# Altium schematic sheet StepperV2.SchDoc
size Letter; SheetNumber: 1; SheetTotal: 1
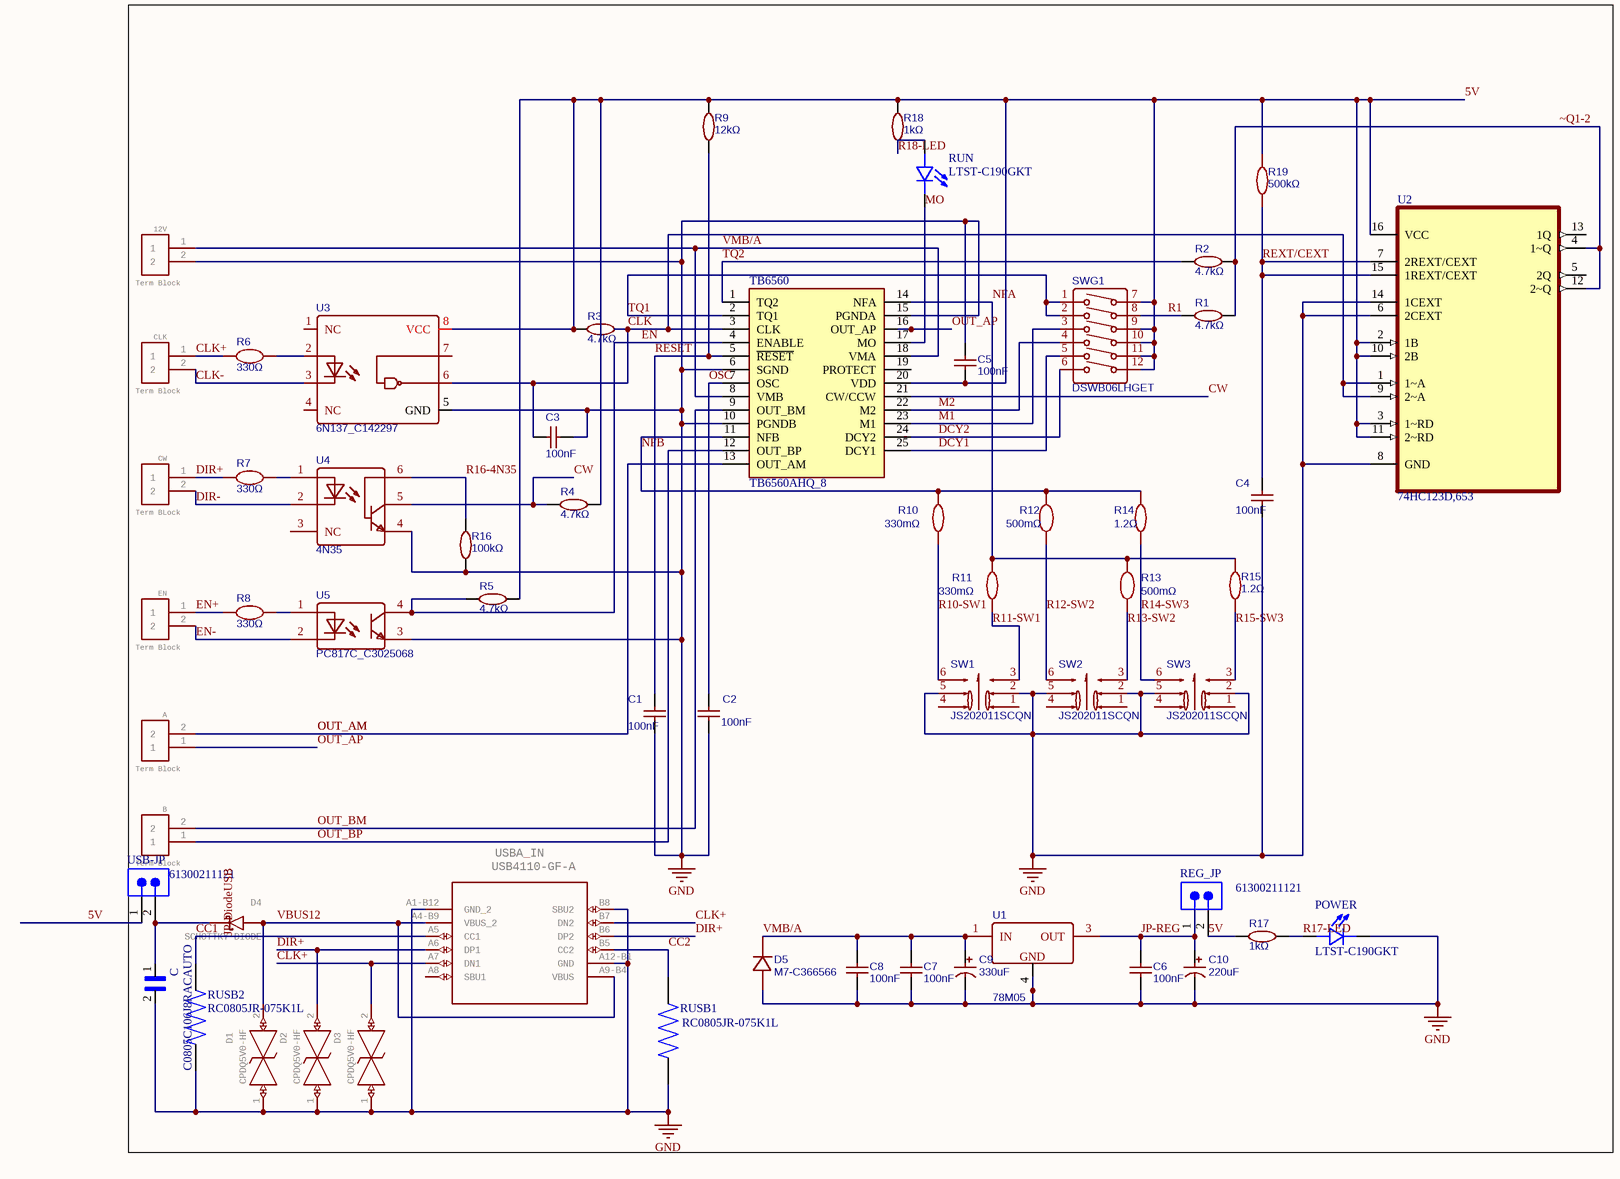
[diagram p0: StepperV2.SchDoc]

## Parts
12V  Term Block  [TE_282837-2]
A  Term Block  [TE_282837-2]
B  Term Block  [TE_282837-2]
C  C0805C106J8RACAUTO  [CAPC2012X88N]
C1  100nF  [C0805]
C2  100nF  [C0805]
C3  100nF  [C0805]
C4  100nF  [C0805]
C5  100nF  [C0805]
C6  100nF  [C0805]
C7  100nF  [C0805]
C8  100nF  [C0805]
C9  330uF  [CAP-TH_BD8.0-P3.50-D0.6-FD]
C10  220uF  [CAP-TH_BD6.3-P2.50-D1.0-FD]
CLK  Term Block  [TE_282837-2]
CW  Term BLock  [TE_282837-2]
D1  CPDQ5V0-HF  [MBTB-D-SOD-923F-IMP-0402]
D2  CPDQ5V0-HF  [MBTB-D-SOD-923F-IMP-0402]
D3  CPDQ5V0-HF  [MBTB-D-SOD-923F-IMP-0402]
D4  SCHOTTKY DIODE  [SOD3715X145N]
D5  M7-C366566  [SMAF_L3.5-W2.6-LS4.7-RD]
EN  Term Block  [TE_282837-2]
POWER  LTST-C190GKT  [LEDC1608X35N]
R1  4.7kΩ  [R0805]
R2  4.7kΩ  [R0805]
R3  4.7kΩ  [R0805]
R4  4.7kΩ  [R0805]
R5  4.7kΩ  [R0805]
R6  330Ω  [R0805]
R7  330Ω  [R0805]
R8  330Ω  [R0805]
R9  12kΩ  [R0805]
R10  330mΩ  [R2512]
R11  330mΩ  [R2512]
R12  500mΩ  [R2512]
R13  500mΩ  [R2512]
R14  1.2Ω  [R1210]
R15  1.2Ω  [R1210]
R16  100kΩ  [R0805]
R17  1kΩ  [R0805]
R18  1kΩ  [R0805]
R19  500kΩ  [R0805]
REG_JP  61300211121  [61300211121]
RUN  LTST-C190GKT  [LEDC1608X35N]
RUSB1  RC0805JR-075K1L  [RESC2012X60N]
RUSB2  RC0805JR-075K1L  [RESC2012X60N]
SW1  JS202011SCQN  [SW-SMD_JS202011SCQN]
SW2  JS202011SCQN  [SW-SMD_JS202011SCQN]
SW3  JS202011SCQN  [SW-SMD_JS202011SCQN]
SWG1  DSWB06LHGET  [SW-TH_DSWB06LHGET]
TB6560  TB6560AHQ_8  [TO127P530X3650X1770-25P]
U1  78M05  [TO-252-2_L6.5-W6.1-P4.58-LS10.0-TL]
U2  74HC123D,653  [SOIC127P600X175-16N]
U3  6N137_C142297  [DIP-8_L9.8-W6.6-P2.54-LS7.6-BL]
U4  4N35  [DIP-6_L8.5-W6.4-P2.54-LS7.6-BL]
U5  PC817C_C3025068  [DIP-4_L4.6-W6.5-P2.54-LS7.6-BL]
USB-JP  61300211121  [61300211121]
USBA_IN  USB4110-GF-A  [USB4110-GF-A_GCT]

## Nets
GND: 12V.2 C.2 C1.1 C2.2 C3.2 C4.1 C5.2 C6.1 C7.1 C8.1 C9.2 C10.2 D1.1(K) D2.1(K) D3.1(K) D5.2(A) POWER.C R16.1 RUSB1.1 RUSB2.1 SW1.2 SW1.5 SW2.2 SW2.5 SW3.2 SW3.5 TB6560.6(SGND) TB6560.10(PGNDB) TB6560.15(PGNDA) U1.4(GND) U2.6(2CEXT) U2.8(GND) U2.14(1CEXT) U3.5(GND) U4.4 U5.3(EM) USBA_IN.A1-B12(GND_2) USBA_IN.A12-B1(GND) USBA_IN.B8(SBU2)
5V: C5.1 R3.1 R4.2 R5.2 R9.2 R17.1 R18.2 R19.2 REG_JP.2 SWG1.7 SWG1.9 SWG1.10 SWG1.11 SWG1.12 TB6560.20(VDD) U2.2(1B) U2.3(1~RD) U2.10(2B) U2.11(2~RD) U2.16(VCC) U3.8(VCC) USB-JP.1
CC1: RUSB2.2 USBA_IN.A5(CC1)  [also labelled JP-DiodeUSB]
CC2: RUSB1.2 USBA_IN.B5(CC2)
CLK: C3.1 R3.2 TB6560.3(CLK) U2.1(1~A) U2.9(2~A) U3.6(VOUT)
CLK+: CLK.1 D3.2(A) R6.1 USBA_IN.A7(DN1) USBA_IN.B7(DN2)
CLK-: CLK.2 U3.3(CAT)
CW: R4.1 TB6560.21(CW/CCW) U4.5
DCY1: SWG1.5 TB6560.25(DCY1)
DCY2: SWG1.6 TB6560.24(DCY2)
DIR+: CW.1 D2.2(A) R7.1 USBA_IN.A6(DP1) USBA_IN.B6(DP2)
DIR-: CW.2 U4.2
EN: R5.1 TB6560.4(ENABLE) U5.4(COL)
EN+: EN.1 R8.1
EN-: EN.2 U5.2(CAT)
JP-REG: C6.2 C10.1 REG_JP.1 U1.3(OUT)
M1: SWG1.3 TB6560.23(M1)
M2: SWG1.4 TB6560.22(M2)
MO: RUN.C TB6560.17(MO)
NFA: R11.2 R13.2 R15.2 TB6560.14(NFA)
NFB: R10.2 R12.2 R14.2 TB6560.11(NFB)
OSC: C2.1 TB6560.7(OSC)
OUT_AM: A.2 TB6560.13(OUT_AM)
OUT_AP: A.1 TB6560.16(OUT_AP)
OUT_BM: B.2 TB6560.9(OUT_BM)
OUT_BP: B.1 TB6560.12(OUT_BP)
R1: R1.1 SWG1.8
R10-SW1: R10.1 SW1.6
R11-SW1: R11.1 SW1.3
R12-SW2: R12.1 SW2.6
R13-SW2: R13.1 SW2.3
R14-SW3: R14.1 SW3.6
R15-SW3: R15.1 SW3.3
R16-4N35: R16.2 U4.6
R17-LED: POWER.A R17.2
R18-LED: R18.1 RUN.A
RESET: C1.2 R9.1 TB6560.5(~{RESET})
REXT/CEXT: C4.2 R19.1 U2.7(2REXT/CEXT) U2.15(1REXT/CEXT)
TQ1: SWG1.1 SWG1.2 TB6560.2(TQ1)
TQ2: R2.1 TB6560.1(TQ2)
VBUS12: D1.2(A) D4.A USBA_IN.A4-B9(VBUS_2) USBA_IN.A9-B4(VBUS)
VMB/A: 12V.1 C7.2 C8.2 C9.1 D5.1(C) TB6560.8(VMB) TB6560.18(VMA) U1.1(IN)
~Q1-2: R1.2 R2.2 U2.4(1~Q) U2.12(2~Q)
NetC_1: C.1 D4.C(K) USB-JP.2
NetR6_2: R6.2 U3.2(AN)
NetR7_2: R7.2 U4.1
NetR8_2: R8.2 U5.1(AN)

Not connected (* = marked no-connect by the designer): SW1 1 4; SW2 1 4; SW3 1 4; TB6560 19(PROTECT); U2 5(2Q) 13(1Q); U3 1(NC) 4(NC) 7(VE); U4 3(NC); USBA_IN A8(SBU1)

## Library data of the parts
12V A B CLK CW EN = 282837-2: GateName_1: G$1; MF: TE Connectivity; SymbolName_1: 282837-2; LibraryName: Terminal_Block2P; DeviceSetName: 282837-2; Package: TE_282837-2; Package: None; Price: None; Check_prices: https://www.snapeda.com/parts/282837-2/TE+Connectivity+AMP+Connectors/view-part/?ref=eda; SnapEDA_Link: https://www.snapeda.com/parts/282837-2/TE+Connectivity+AMP+Connectors/view-part/?ref=snap; MP: 282837-2; Availability: In Stock; Purchase-URL: https://pricing.snapeda.com/search?q=282837-2&ref=eda
C = C0805C106J8RACAUTO: 10ÂµF Â±5% 10V Ceramic Capacitor X7R 0805 _2012 Metric_; MF: KEMET; Price: None; SnapEDA_Link: https://www.snapeda.com/parts/C0805C106J8RACAUTO/KEMET/view-part/3596814/?ref=snap; MP: C0805C106J8RACAUTO; Availability: Unavailable; Value: *; Package: 0805 KEMET
C1-C8 = 100nF: Manufacturer: FH(风华); Manufacturer Part: 0805B104J500NT; nameAlias: Value; Supplier: LCSC; Supplier Part: C29926; JLCPCB Part Class: Extended Part; spicePre: C; spiceSymbolName: 0805B104J500NT
C9 = 330uF: Manufacturer: CX(承兴); Manufacturer Part: GR337M050F20RR0VL4FP0; nameAlias: Value; Supplier: LCSC; Supplier Part: C45106; JLCPCB Part Class: Extended Part; spicePre: C; spiceSymbolName: 330uF 50V 8*20Green high frequency
C10 = 220uF: Manufacturer: CX(承兴); Manufacturer Part: KM227M016E11RR0VH2FP0; nameAlias: Value; Supplier: LCSC; Supplier Part: C43349; JLCPCB Part Class: Extended Part; spicePre: C; spiceSymbolName: 220uF 16V 6.3*11
D1-D3 = CPDQ5V0-HF: ESD Suppressors / TVS Diodes SMD ESD Diode 5V Bi-Direction   Source:  Datasheet   Check availability; GateName_1: G$1; MF: Comchip Technology; SymbolName_1: CPDQ5V0-HF; LibraryName: CPDQ5V0-HF; DeviceSetName: CPDQ5V0-HF; Package: MBTB-D-SOD-923F-IMP-0402; Package: 0402 Comchip; Price: None; Check_prices: https://www.snapeda.com/parts/CPDQ5V0-HF/Comchip+Technology/view-part/?ref=eda; SnapEDA_Link: https://www.snapeda.com/parts/CPDQ5V0-HF/Comchip+Technology/view-part/?ref=snap; MP: CPDQ5V0-HF; Availability: In Stock; Purchase-URL: https://www.snapeda.com/api/url_track_click_mouser/?unipart_id=809934&manufacturer=Comchip Technology&part_name=CPDQ5V0-HF&search_term=cpdq5v0-hf
D4 = 1N5819HW-7-F: GateName_1: G$1; MF: Diodes Inc.; SymbolName_1: 1N5819HW-7-F; LibraryName: 1N5819HW-7-F; DeviceSetName: 1N5819HW-7-F; Package: SOD3715X145N; Package: SOD-123 Fairchild Semiconductor; Price: None; Check_prices: https://www.snapeda.com/parts/1N5819HW-7-F/Diodes+Inc./view-part/?ref=eda; SnapEDA_Link: https://www.snapeda.com/parts/1N5819HW-7-F/Diodes+Inc./view-part/?ref=snap; MP: 1N5819HW-7-F; Availability: In Stock; Purchase-URL: https://www.snapeda.com/api/url_track_click_mouser/?unipart_id=42272&manufacturer=Diodes Inc.&part_name=1N5819HW-7-F&search_term=1n5819hw-7-f
D5 = M7-C366566: Manufacturer: DOWO(东沃); Manufacturer Part: M7; Contributor: LCSC; Supplier: LCSC; Supplier Part: C366566; JLCPCB Part Class: Extended Part; spicePre: D; spiceSymbolName: M7-C366566
POWER RUN = LTST-C190GKT: LED; SMD; 0603; Green; 18-180mcd; 1.6x0.8x0.8mm; 130Â°; 1.6Ã·2.4V; 20mA <a href="https://pricing.snapeda.com/parts/LTST-C190GKT/Lite-On%20Inc./view-part?ref=eda">Check availability</a>; MF: {'manufacturer': u'Lite-On Inc.'}; Package: None; Price: None; Value: *; MP: LTST-C190GKT; Availability: Unavailable
R1-R5 = 4.7kΩ: Manufacturer: FH(风华); Manufacturer Part: RS-05K472JT; nameAlias: Value; Supplier: LCSC; Supplier Part: C115310; JLCPCB Part Class: Extended Part; spicePre: R; spiceSymbolName: RS-05K472JT
R6-R8 = 330Ω: Manufacturer: EVER OHMS(天二科技); Manufacturer Part: CR0805J330RP05Z; Contributor: LCSC; nameAlias: Value; Supplier: LCSC; Supplier Part: C881004; JLCPCB Part Class: Extended Part; spicePre: R; spiceSymbolName: CR0805J330RP05Z
R9 = 12kΩ: Manufacturer: UNI-ROYAL(厚声); Manufacturer Part: 0805W8J0123T5E; nameAlias: Value; Supplier: LCSC; Supplier Part: C25616; JLCPCB Part Class: Extended Part; spicePre: R; spiceSymbolName: 0805W8J0123T5E
R10 R11 = 330mΩ: Manufacturer: EVER OHMS(天二科技); Manufacturer Part: CRH2512JR330E04Z; nameAlias: Value; Contributor: LCSC; Supplier: LCSC; Supplier Part: C176087; JLCPCB Part Class: Extended Part; spicePre: R; spiceSymbolName: CR2512J0R33E042W
R12 R13 = 500mΩ: Manufacturer: SEI(Stackpole Electronics Inc.); Manufacturer Part: CSRN2512FKR500; nameAlias: Value; Contributor: LCSC; Supplier: LCSC; Supplier Part: C346810; JLCPCB Part Class: Extended Part; spicePre: R; spiceSymbolName: CSRN2512FKR500
R14 R15 = 1.2Ω: Manufacturer: EVER OHMS(天二科技); Manufacturer Part: CR1210F1R20P05S; nameAlias: Value; Contributor: LCSC; Supplier: LCSC; Supplier Part: C174381; JLCPCB Part Class: Extended Part; spicePre: R; spiceSymbolName: CR1210F1R2P05
R16 = 100kΩ: Manufacturer: RALEC(旺诠); Manufacturer Part: RTT05104JTP; nameAlias: Value; Supplier: LCSC; Supplier Part: C103915; JLCPCB Part Class: Extended Part; spicePre: R; spiceSymbolName: RTT05104JTP
R17 R18 = 1kΩ: Manufacturer: YAGEO(国巨); Manufacturer Part: RC0805JR-071KL; nameAlias: Value; Supplier: LCSC; Supplier Part: C100046; JLCPCB Part Class: Extended Part; spicePre: R; spiceSymbolName: RC0805JR-071KL
R19 = 500kΩ: Manufacturer: Viking(光颉); Manufacturer Part: AR05BTCW5003; nameAlias: Value; Contributor: LCSC; Supplier: LCSC; Supplier Part: C316218; JLCPCB Part Class: Extended Part; spicePre: R; spiceSymbolName: AR05BTCW5003
REG_JP USB-JP = CMP-1712-00002-5: NexarPartId: 20081794; Operating Supply Voltage: 250V; Current Rating: 3A; Gender: Male; Number of Contacts: 2; Pitch: 2.54mm; Connector Type: Male Pin; Contact Resistance: 20mΩ; Contact Plating: Gold; Contact Material: Copper; Number of Pins: 2; Min Operating Temperature: -40°C; Packaging: Bulk; Lead Pitch: 2.54mm; Mount: Through Hole; Orientation: Vertical; RoHS: Compliant; REACH SVHC: No SVHC; Height: 8.94mm; Termination: Through Hole; Number of Positions: 2; Contact Mating Length: 5.9944mm; Color: Black; Contact Gender: Male; Number of Rows: 1; Housing Material: PBT; Lead Free: Lead Free; Voltage Rating: 250V; Max Operating Temperature: 125°C
RUSB1 RUSB2 = RC0805JR-075K1L: RC0805 5,1K 5% 0,125W; Package: None; Price: None; Value: *; MP: RC0805JR-075K1L; Availability: Unavailable
SW1-SW3 = JS202011SCQN: Manufacturer: C&K; Contributor: LCSC; Supplier: LCSC; Supplier Part: C221666; Manufacturer Part: JS202011SCQN; JLCPCB Part Class: Extended Part; spicePre: S; spiceSymbolName: JS202011SCQN
SWG1 = DSWB06LHGET: Manufacturer: YE; Contributor: LCSC; Supplier: LCSC; Supplier Part: C99416; Manufacturer Part: DSWB06LHGET; JLCPCB Part Class: Extended Part; spicePre: S; spiceSymbolName: DSWB06LHGET
TB6560 = TB6560AHQ_8: Motor / Motion / Ignition Controllers & Drivers Stepping Motor Driver IC; Manufacturer_Name: Toshiba; Manufacturer_Part_Number: TB6560AHQ,8; Geometry.Height: 5.3mm; TTI Part Number: *; TTI Price/Stock: *; Datasheet Link: http://toshiba.semicon-storage.com/info/docget.jsp?did=11252&prodName=TB6560AHQ
U1 = 78M05: Manufacturer: SHIKUES(时科); Supplier: LCSC; Manufacturer Part: 78M05; Supplier Part: C111265; JLCPCB Part Class: Extended Part; spicePre: U; spiceSymbolName: 78M05
U2 = 74HC123D,653: Monostable Multivibrator 65ns 16-SO; MF: Nexperia USA; Value: *; Purchase-URL: https://pricing.snapeda.com/search/part/74HC123D,653/?ref=eda; Package: SO16-16 Nexperia USA Inc.; MP: 74HC123D,653; Check_prices: https://www.snapeda.com/parts/74HC123D,653/Nexperia/view-part/2882374/?ref=eda; SnapEDA_Link: https://www.snapeda.com/parts/74HC123D,653/Nexperia/view-part/2882374/?ref=snap; Digi-Key_Part_Number: 1727-2778-1-ND
U3 = 6N137_C142297: Manufacturer: EVERLIGHT(亿光); Manufacturer Part: 6N137; Contributor: LCSC; Supplier: LCSC; Supplier Part: C142297; JLCPCB Part Class: Extended Part; spicePre: U; spiceSymbolName: 6N137_C142297
U4 = 4N35: Manufacturer: EVERLIGHT(亿光); Supplier: LCSC; Manufacturer Part: 4N35; Supplier Part: C57084; JLCPCB Part Class: Extended Part; spicePre: U; spiceSymbolName: 4N35
U5 = PC817C_C3025068: Manufacturer: GOODWORK(固得沃克); Manufacturer Part: PC817C; Contributor: lcsc; Supplier: LCSC; Supplier Part: C3025068; JLCPCB Part Class: Extended Part; spicePre: U; spiceSymbolName: PC817C_C3025068
USBA_IN = USB4110-GF-A: MFR_NAME: Global Connector Technology; GateName_1: A; SymbolName_1: USB4110-GF-A; LibraryName: USB4110-GF-A; DeviceSetName: USB4110-GF-A; Package: USB4110-GF-A_GCT; COPYRIGHT: Copyright (C) 2023 Ultra Librarian. All rights reserved.; MANUFACTURER_PART_NUMBER: USB4110-GF-A